# EasyEDA schematic SCH_ledAndButonMcp23017_2023-08-30.json
TITLE: Sheet_1; REV: 1.0; Date: 2023-01-26; Sheet: 1/1; Drawn By: bigjohnson; Company: Your Company
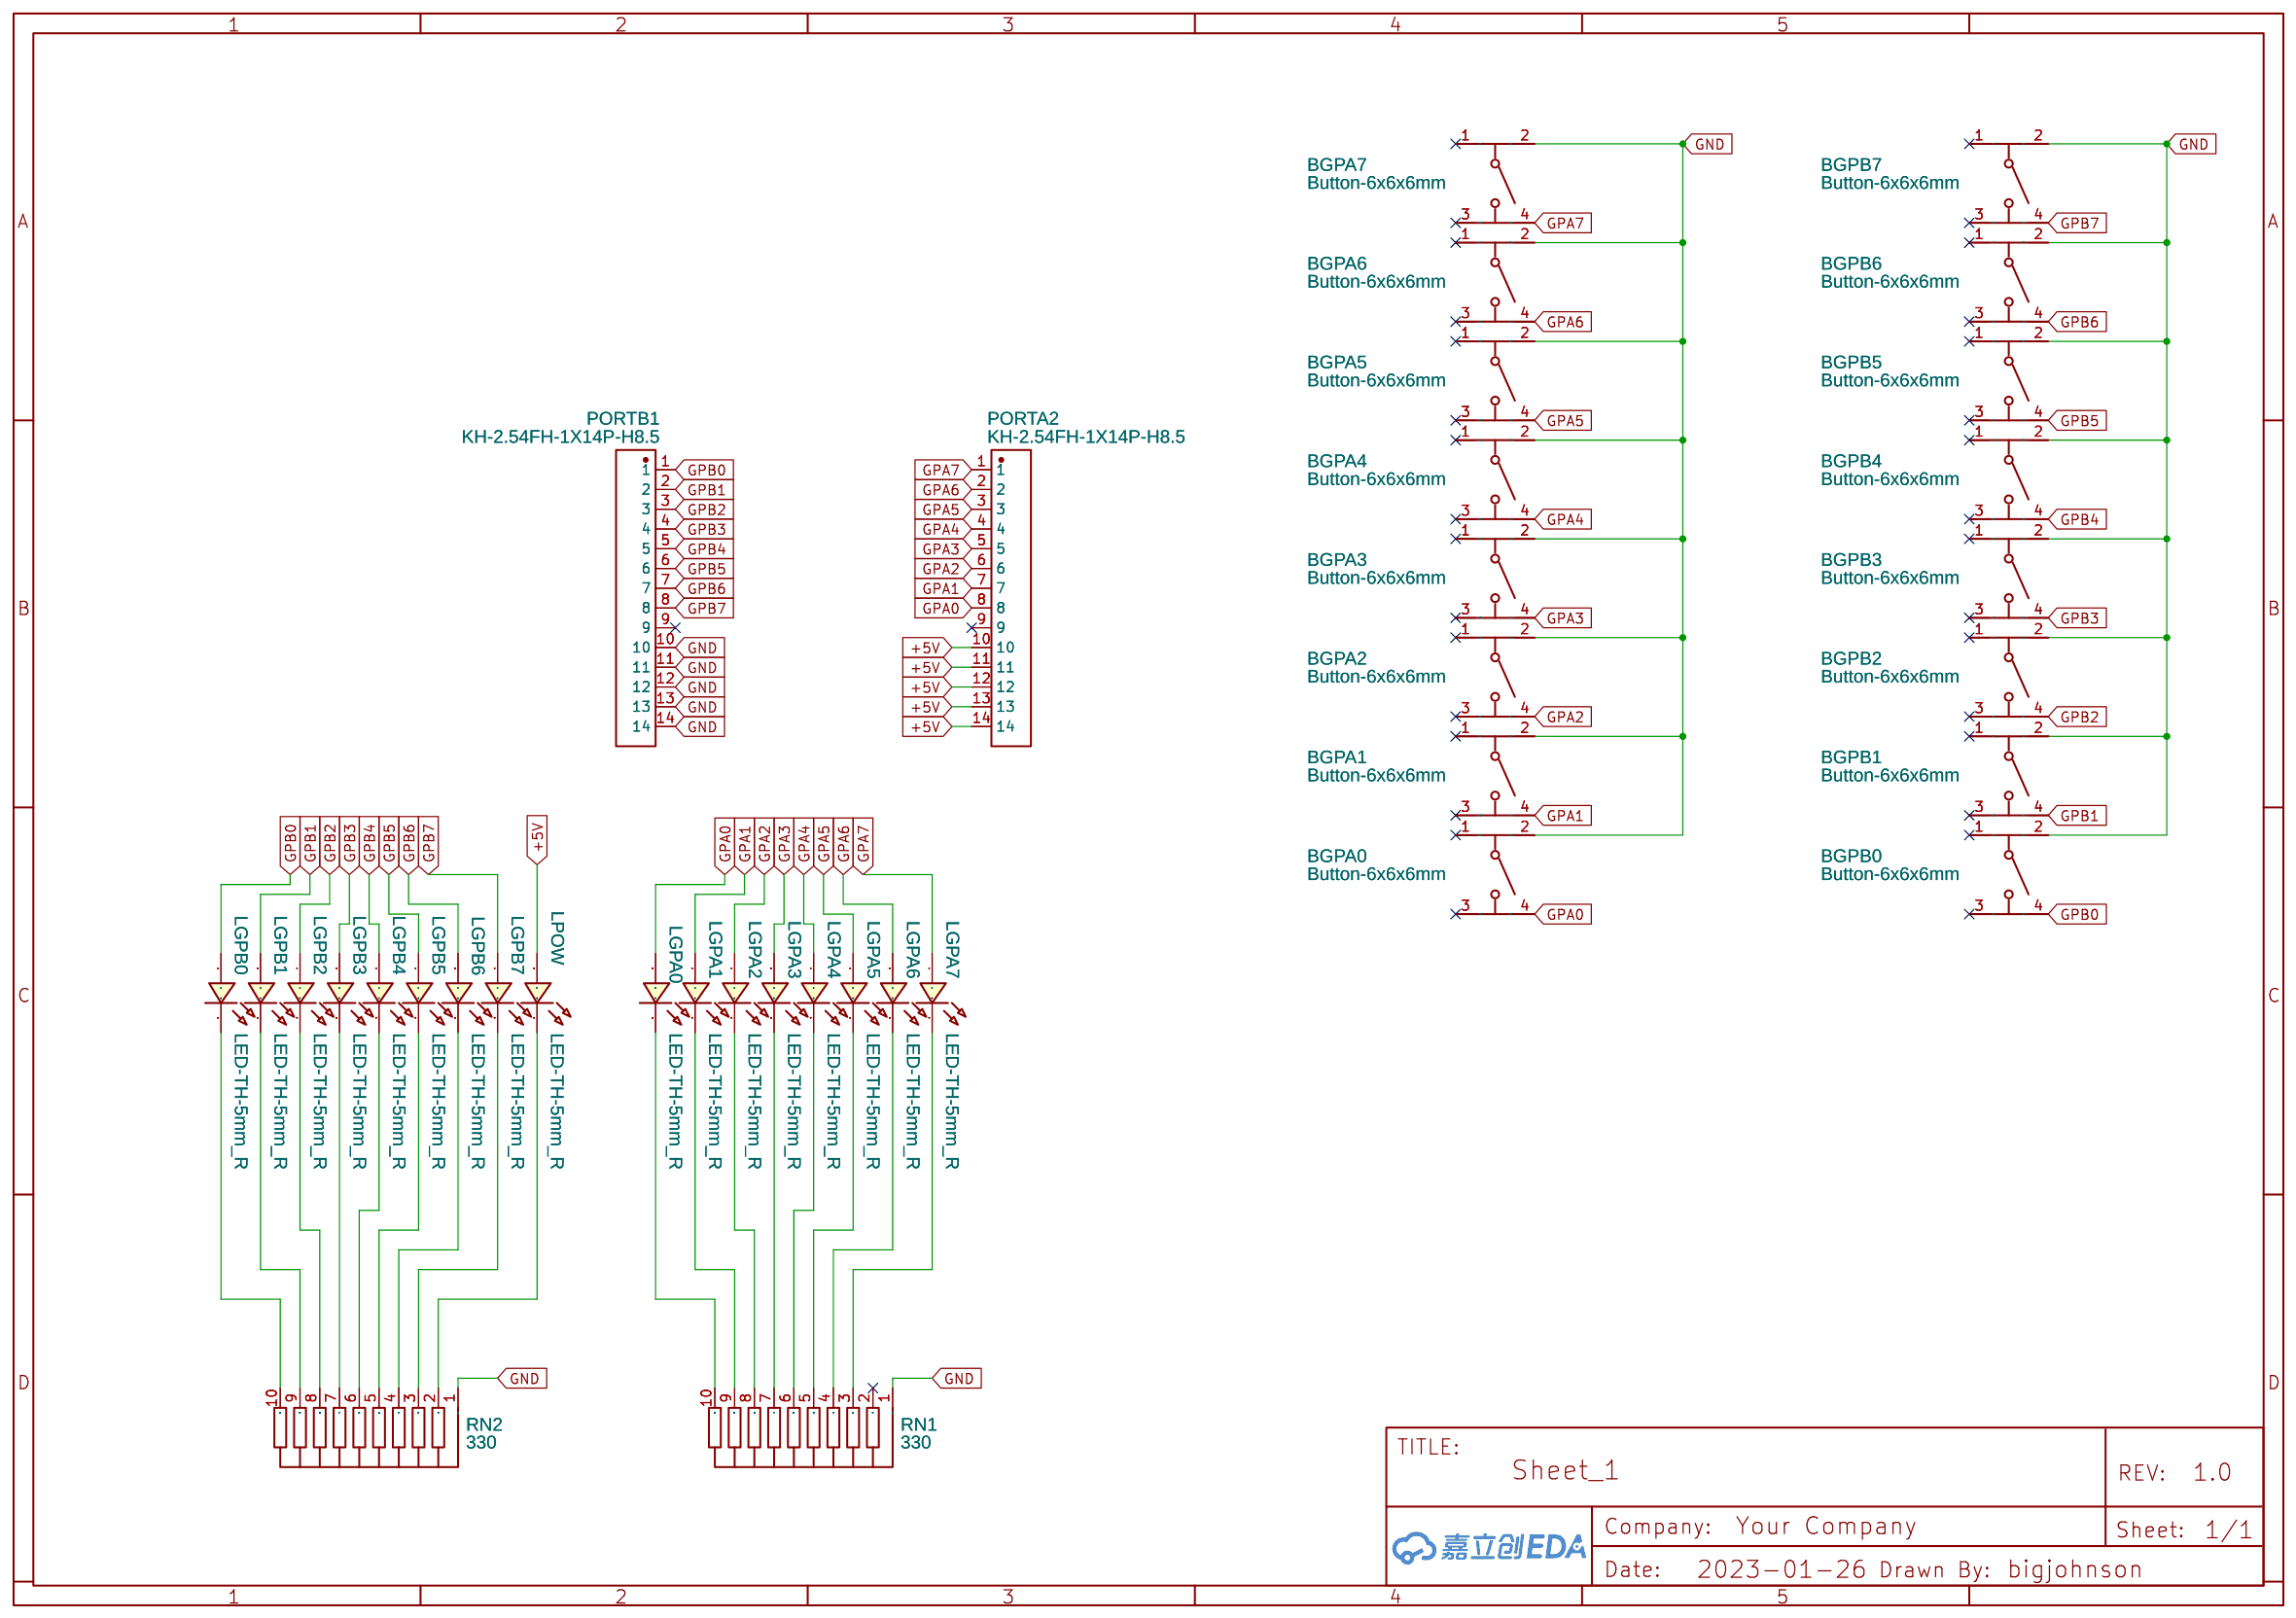
[diagram p0: schematic sheet]

## Parts
BGPA0  Button-6x6x6mm  [SW-TH_4P-L6.0-W6.0-P4.50-LS6.1]
BGPA1  Button-6x6x6mm  [SW-TH_4P-L6.0-W6.0-P4.50-LS6.1]
BGPA2  Button-6x6x6mm  [SW-TH_4P-L6.0-W6.0-P4.50-LS6.1]
BGPA3  Button-6x6x6mm  [SW-TH_4P-L6.0-W6.0-P4.50-LS6.1]
BGPA4  Button-6x6x6mm  [SW-TH_4P-L6.0-W6.0-P4.50-LS6.1]
BGPA5  Button-6x6x6mm  [SW-TH_4P-L6.0-W6.0-P4.50-LS6.1]
BGPA6  Button-6x6x6mm  [SW-TH_4P-L6.0-W6.0-P4.50-LS6.1]
BGPA7  Button-6x6x6mm  [SW-TH_4P-L6.0-W6.0-P4.50-LS6.1]
BGPB0  Button-6x6x6mm  [SW-TH_4P-L6.0-W6.0-P4.50-LS6.1]
BGPB1  Button-6x6x6mm  [SW-TH_4P-L6.0-W6.0-P4.50-LS6.1]
BGPB2  Button-6x6x6mm  [SW-TH_4P-L6.0-W6.0-P4.50-LS6.1]
BGPB3  Button-6x6x6mm  [SW-TH_4P-L6.0-W6.0-P4.50-LS6.1]
BGPB4  Button-6x6x6mm  [SW-TH_4P-L6.0-W6.0-P4.50-LS6.1]
BGPB5  Button-6x6x6mm  [SW-TH_4P-L6.0-W6.0-P4.50-LS6.1]
BGPB6  Button-6x6x6mm  [SW-TH_4P-L6.0-W6.0-P4.50-LS6.1]
BGPB7  Button-6x6x6mm  [SW-TH_4P-L6.0-W6.0-P4.50-LS6.1]
LGPA0  LED-TH-5mm_R  [LED-TH_BD5.0_RED]
LGPA1  LED-TH-5mm_R  [LED-TH_BD5.0_RED]
LGPA2  LED-TH-5mm_R  [LED-TH_BD5.0_RED]
LGPA3  LED-TH-5mm_R  [LED-TH_BD5.0_RED]
LGPA4  LED-TH-5mm_R  [LED-TH_BD5.0_RED]
LGPA5  LED-TH-5mm_R  [LED-TH_BD5.0_RED]
LGPA6  LED-TH-5mm_R  [LED-TH_BD5.0_RED]
LGPA7  LED-TH-5mm_R  [LED-TH_BD5.0_RED]
LGPB0  LED-TH-5mm_R  [LED-TH_BD5.0_RED]
LGPB1  LED-TH-5mm_R  [LED-TH_BD5.0_RED]
LGPB2  LED-TH-5mm_R  [LED-TH_BD5.0_RED]
LGPB3  LED-TH-5mm_R  [LED-TH_BD5.0_RED]
LGPB4  LED-TH-5mm_R  [LED-TH_BD5.0_RED]
LGPB5  LED-TH-5mm_R  [LED-TH_BD5.0_RED]
LGPB6  LED-TH-5mm_R  [LED-TH_BD5.0_RED]
LGPB7  LED-TH-5mm_R  [LED-TH_BD5.0_RED]
LPOW  LED-TH-5mm_R  [LED-TH_BD5.0_RED]
PORTA2  KH-2.54FH-1X14P-H8.5  [HDR-TH_14P-P2.54-V-F]
PORTB1  KH-2.54FH-1X14P-H8.5  [HDR-TH_14P-P2.54-V-F]
RN1  330  [RES-ARRAY-TH_10P-P2.54-D1.0]
RN2  330  [RES-ARRAY-TH_10P-P2.54-D1.0]

## Library data of the parts
BGPA0-BGPA7 BGPB0-BGPB7 = Button-6x6x6mm: Supplier Part: C71836; Supplier: LCSC; Manufacturer: BBJ; Manufacturer Part: Switch,6*6*6Plastic head,260G, 0.25mm,Straight line
LGPA0-LGPA7 LGPB0-LGPB7 LPOW = LED-TH-5mm_R: Manufacturer: EVERLIGHT(台湾亿光); Manufacturer Part: 333-2SURD/S530-A3; Supplier Part: C87271; Supplier: LCSC; Contributor: LCEDA_Lib
PORTA2 PORTB1 = KH-2.54FH-1X14P-H8.5: Supplier: LCSC; Supplier Part: C2905420; Manufacturer: kinghelm(金航标); Contributor: LCSC; JLCPCB Part Class: Extended Part
RN1 RN2 = RAA10103G: Supplier: LCSC; Supplier Part: C353599; Manufacturer: ZHUHAI MONEC ELEC; Contributor: LCSC; LCSC Assembly: Yes; SMT Type: Extend; Paste Type: expand

## Nets
+5V: LPOW.1 PORTA2.10 PORTA2.11 PORTA2.12 PORTA2.13 PORTA2.14
GND: BGPA0.2 BGPA1.2 BGPA2.2 BGPA3.2 BGPA4.2 BGPA5.2 BGPA6.2 BGPA7.2 BGPB0.2 BGPB1.2 BGPB2.2 BGPB3.2 BGPB4.2 BGPB5.2 BGPB6.2 BGPB7.2 PORTB1.10 PORTB1.11 PORTB1.12 PORTB1.13 PORTB1.14 RN1.1 RN2.1
GPA0: BGPA0.4 LGPA0.1 PORTA2.8
GPA1: BGPA1.4 LGPA1.1 PORTA2.7
GPA2: BGPA2.4 LGPA2.1 PORTA2.6
GPA3: BGPA3.4 LGPA3.1 PORTA2.5
GPA4: BGPA4.4 LGPA4.1 PORTA2.4
GPA5: BGPA5.4 LGPA5.1 PORTA2.3
GPA6: BGPA6.4 LGPA6.1 PORTA2.2
GPA7: BGPA7.4 LGPA7.1 PORTA2.1
GPB0: BGPB0.4 LGPB0.1 PORTB1.1
GPB1: BGPB1.4 LGPB1.1 PORTB1.2
GPB2: BGPB2.4 LGPB2.1 PORTB1.3
GPB3: BGPB3.4 LGPB3.1 PORTB1.4
GPB4: BGPB4.4 LGPB4.1 PORTB1.5
GPB5: BGPB5.4 LGPB5.1 PORTB1.6
GPB6: BGPB6.4 LGPB6.1 PORTB1.7
GPB7: BGPB7.4 LGPB7.1 PORTB1.8
Net-(LGPA0-2): LGPA0.2 RN1.10
Net-(LGPA1-2): LGPA1.2 RN1.9
Net-(LGPA2-2): LGPA2.2 RN1.8
Net-(LGPA3-2): LGPA3.2 RN1.7
Net-(LGPA4-2): LGPA4.2 RN1.6
Net-(LGPA5-2): LGPA5.2 RN1.5
Net-(LGPA6-2): LGPA6.2 RN1.4
Net-(LGPA7-2): LGPA7.2 RN1.3
Net-(LGPB0-2): LGPB0.2 RN2.10
Net-(LGPB1-2): LGPB1.2 RN2.9
Net-(LGPB2-2): LGPB2.2 RN2.8
Net-(LGPB3-2): LGPB3.2 RN2.7
Net-(LGPB4-2): LGPB4.2 RN2.6
Net-(LGPB5-2): LGPB5.2 RN2.5
Net-(LGPB6-2): LGPB6.2 RN2.4
Net-(LGPB7-2): LGPB7.2 RN2.3
Net-(LPOW-2): LPOW.2 RN2.2

Not connected (* = marked no-connect by the designer): BGPA0 1* 3*; BGPA1 1* 3*; BGPA2 1* 3*; BGPA3 1* 3*; BGPA4 1* 3*; BGPA5 1* 3*; BGPA6 1* 3*; BGPA7 1* 3*; BGPB0 1* 3*; BGPB1 1* 3*; BGPB2 1* 3*; BGPB3 1* 3*; BGPB4 1* 3*; BGPB5 1* 3*; BGPB6 1* 3*; BGPB7 1* 3*; PORTA2 9*; PORTB1 9*; RN1 2*
